# Altium schematic sheet tie-mib-term0.SchDoc: Copper Suicide - Net Tie MIBT0
size Letter; CheckedBy: J. Brinton; CompanyName: Signal Laboratories, Inc.; DrawnBy: J. Brinton; Engineer: J. Brinton; Address1: 3479 Edison Way; Address2: Menlo Park CA 94025; Address3: +1 (877) 778-8435; Address4: siglabs.com; Revision: 3; SheetNumber: 31; SheetTotal: 47
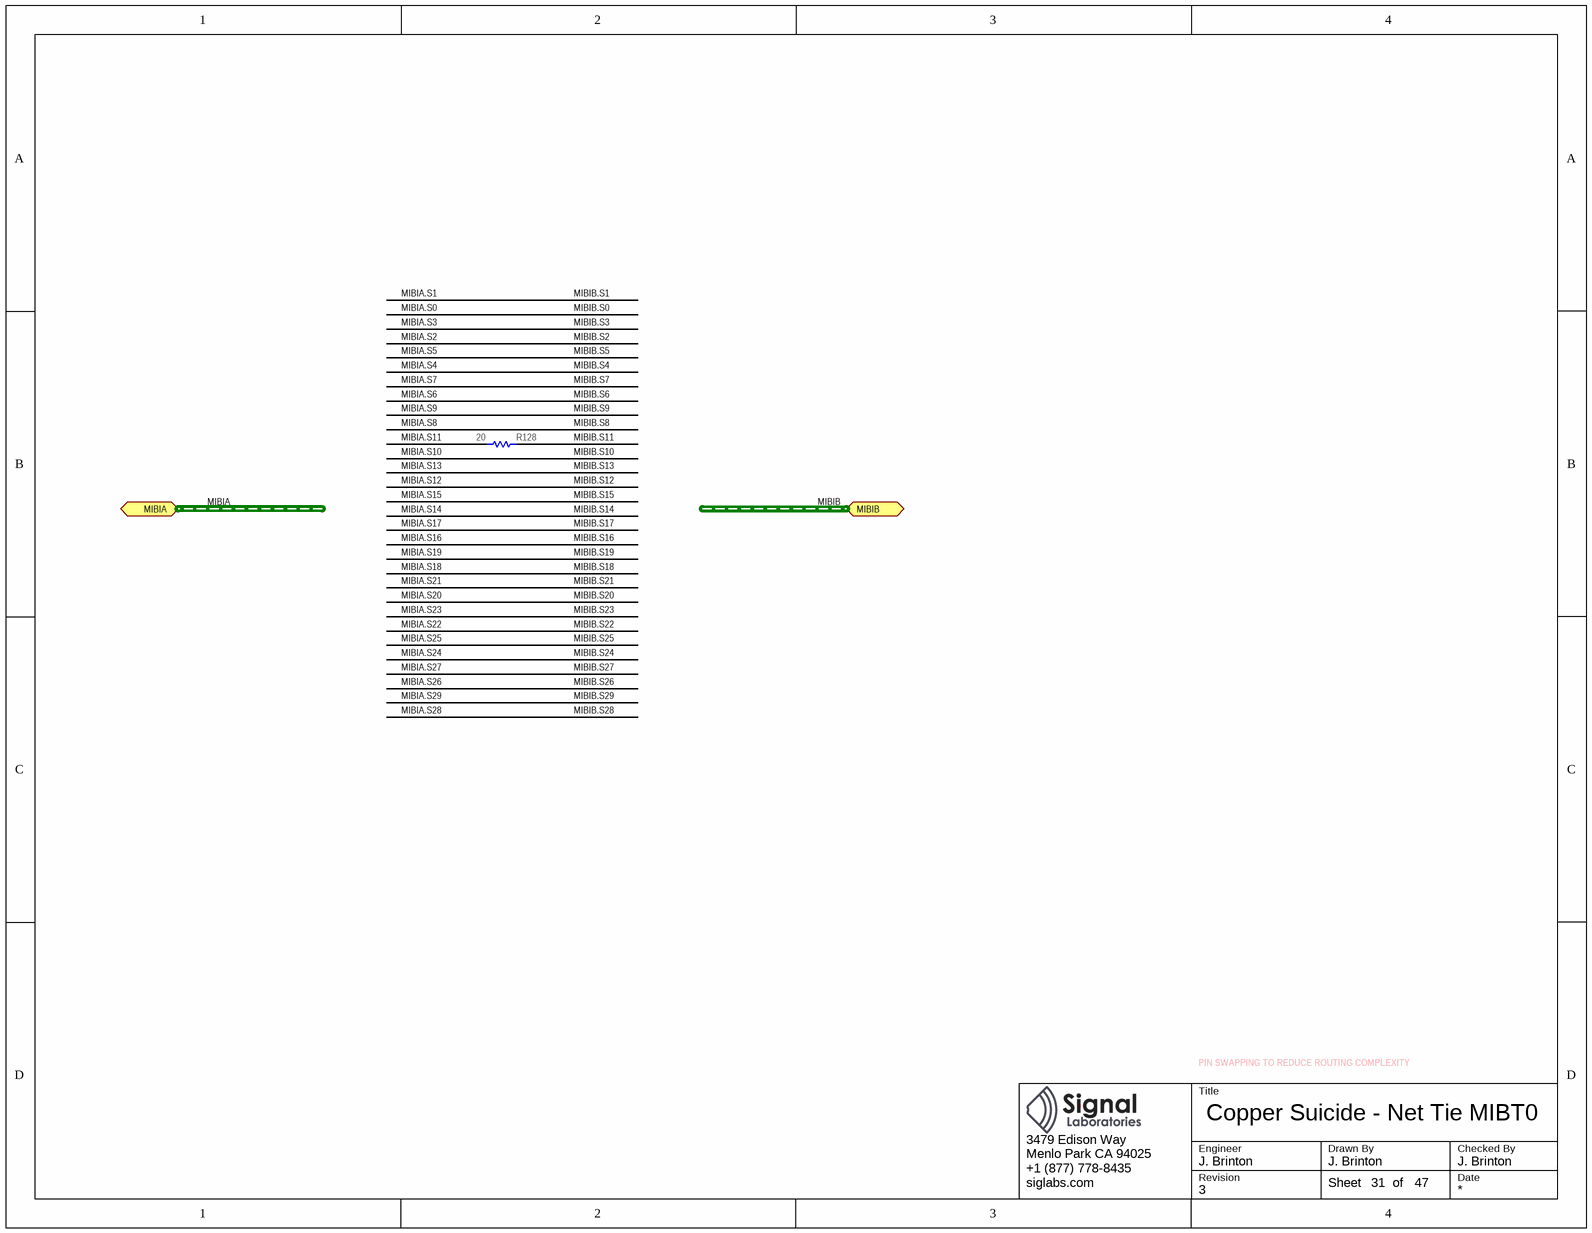
[diagram p0: tie-mib-term0.SchDoc]

## Parts
R128  value 20  [RESC1005X40N]  (hidden comment: ERJ-2RKF20R0X)

## Ports
MIBIA (harness MIB), MIBIB (harness MIB)

## Nets
MIBIA.S11: R128.1
MIBIB.S11: R128.2

## Buses and harness runs
harness MIBIA = port MIBIA
harness MIBIB = port MIBIB

## Notes on the sheet
- PIN SWAPPING TO REDUCE ROUTING COMPLEXITY
- Title
- Engineer
- Revision
- Drawn By
- Checked By
- Date
- Sheet
- of

## Library data of the parts
R128 = RES: Thick Film Resistor 20 ±1% 0.1W 75V 0402; Manufacturer: Panasonic; Tcr: ±100; Tr: -55:155; Voltage: 75; Power: 0.1; Tolerance: ±1%; Manufacturer P/N: ERJ-2RKF20R0X; Alternatives: *; Footprint: *; Package: 0402